# EAGLE schematic 2nd_version (EAGLE 7.3.0)
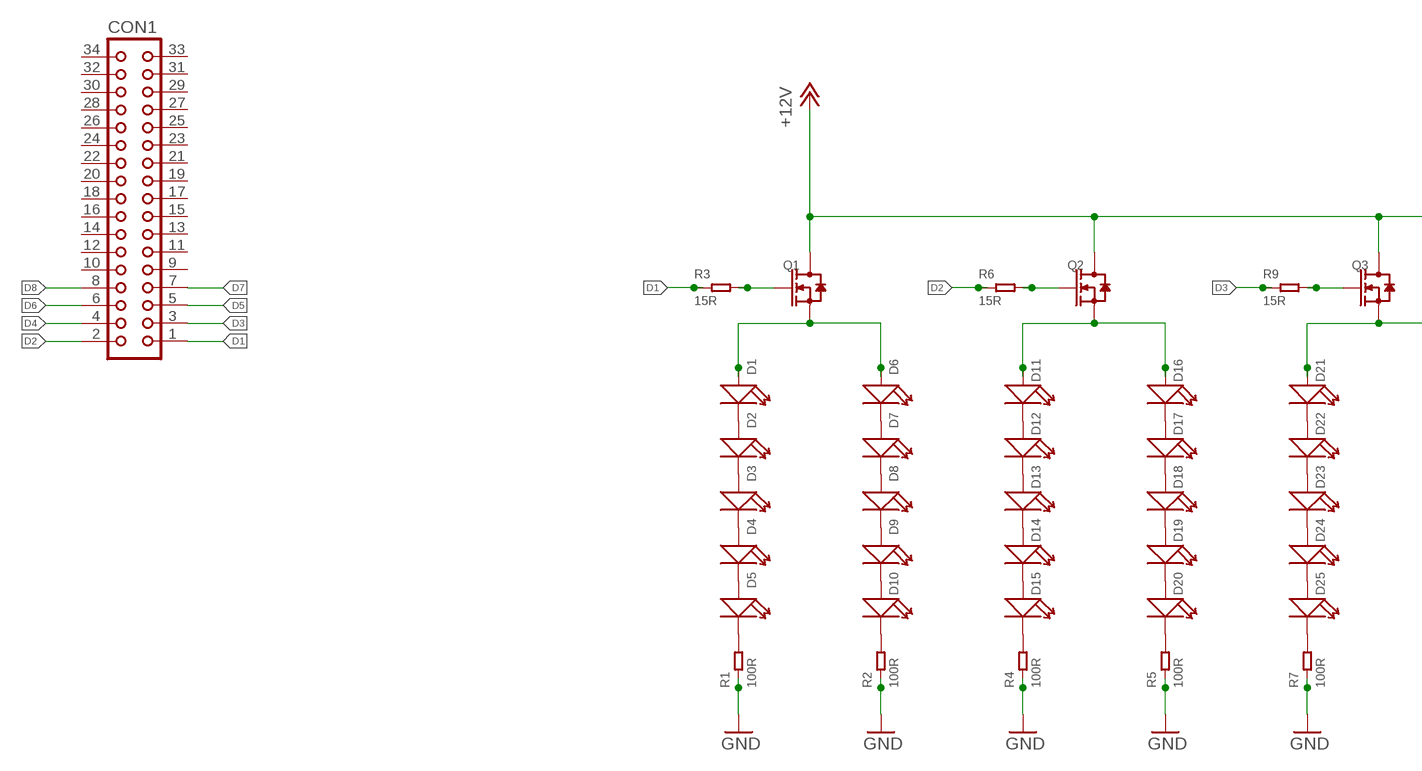
[diagram p0: schematic, sheet 1, part 1 of 2]
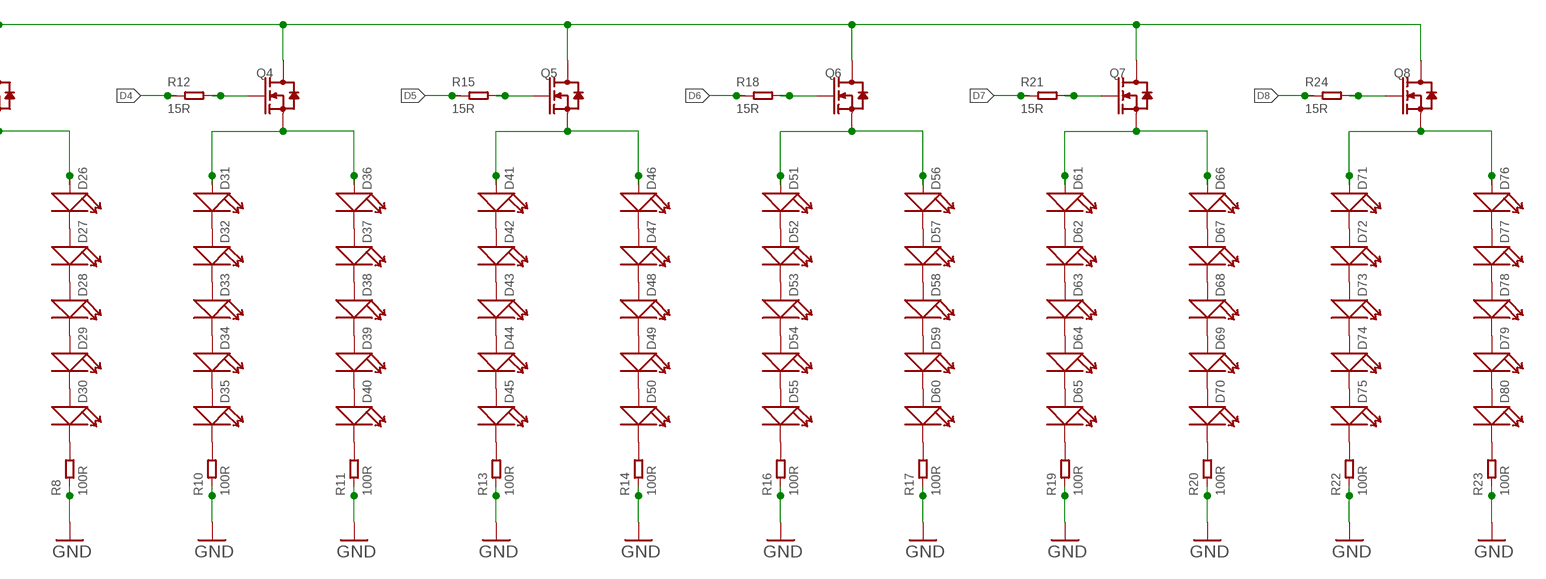
[diagram p1: schematic, sheet 1, part 2 of 2]

## Parts
CON1  CON34L  [CON34L]
D1  SMD-LED-CLEAR-YELLOW(0603)  [LED-0603]
D2  SMD-LED-CLEAR-YELLOW(0603)  [LED-0603]
D3  SMD-LED-CLEAR-YELLOW(0603)  [LED-0603]
D4  SMD-LED-CLEAR-YELLOW(0603)  [LED-0603]
D5  SMD-LED-CLEAR-YELLOW(0603)  [LED-0603]
D6  SMD-LED-CLEAR-YELLOW(0603)  [LED-0603]
D7  SMD-LED-CLEAR-YELLOW(0603)  [LED-0603]
D8  SMD-LED-CLEAR-YELLOW(0603)  [LED-0603]
D9  SMD-LED-CLEAR-YELLOW(0603)  [LED-0603]
D10  SMD-LED-CLEAR-YELLOW(0603)  [LED-0603]
D11  SMD-LED-CLEAR-YELLOW(0603)  [LED-0603]
D12  SMD-LED-CLEAR-YELLOW(0603)  [LED-0603]
D13  SMD-LED-CLEAR-YELLOW(0603)  [LED-0603]
D14  SMD-LED-CLEAR-YELLOW(0603)  [LED-0603]
D15  SMD-LED-CLEAR-YELLOW(0603)  [LED-0603]
D16  SMD-LED-CLEAR-YELLOW(0603)  [LED-0603]
D17  SMD-LED-CLEAR-YELLOW(0603)  [LED-0603]
D18  SMD-LED-CLEAR-YELLOW(0603)  [LED-0603]
D19  SMD-LED-CLEAR-YELLOW(0603)  [LED-0603]
D20  SMD-LED-CLEAR-YELLOW(0603)  [LED-0603]
D21  SMD-LED-CLEAR-YELLOW(0603)  [LED-0603]
D22  SMD-LED-CLEAR-YELLOW(0603)  [LED-0603]
D23  SMD-LED-CLEAR-YELLOW(0603)  [LED-0603]
D24  SMD-LED-CLEAR-YELLOW(0603)  [LED-0603]
D25  SMD-LED-CLEAR-YELLOW(0603)  [LED-0603]
D26  SMD-LED-CLEAR-YELLOW(0603)  [LED-0603]
D27  SMD-LED-CLEAR-YELLOW(0603)  [LED-0603]
D28  SMD-LED-CLEAR-YELLOW(0603)  [LED-0603]
D29  SMD-LED-CLEAR-YELLOW(0603)  [LED-0603]
D30  SMD-LED-CLEAR-YELLOW(0603)  [LED-0603]
D31  SMD-LED-CLEAR-YELLOW(0603)  [LED-0603]
D32  SMD-LED-CLEAR-YELLOW(0603)  [LED-0603]
D33  SMD-LED-CLEAR-YELLOW(0603)  [LED-0603]
D34  SMD-LED-CLEAR-YELLOW(0603)  [LED-0603]
D35  SMD-LED-CLEAR-YELLOW(0603)  [LED-0603]
D36  SMD-LED-CLEAR-YELLOW(0603)  [LED-0603]
D37  SMD-LED-CLEAR-YELLOW(0603)  [LED-0603]
D38  SMD-LED-CLEAR-YELLOW(0603)  [LED-0603]
D39  SMD-LED-CLEAR-YELLOW(0603)  [LED-0603]
D40  SMD-LED-CLEAR-YELLOW(0603)  [LED-0603]
D41  SMD-LED-CLEAR-YELLOW(0603)  [LED-0603]
D42  SMD-LED-CLEAR-YELLOW(0603)  [LED-0603]
D43  SMD-LED-CLEAR-YELLOW(0603)  [LED-0603]
D44  SMD-LED-CLEAR-YELLOW(0603)  [LED-0603]
D45  SMD-LED-CLEAR-YELLOW(0603)  [LED-0603]
D46  SMD-LED-CLEAR-YELLOW(0603)  [LED-0603]
D47  SMD-LED-CLEAR-YELLOW(0603)  [LED-0603]
D48  SMD-LED-CLEAR-YELLOW(0603)  [LED-0603]
D49  SMD-LED-CLEAR-YELLOW(0603)  [LED-0603]
D50  SMD-LED-CLEAR-YELLOW(0603)  [LED-0603]
D51  SMD-LED-CLEAR-YELLOW(0603)  [LED-0603]
D52  SMD-LED-CLEAR-YELLOW(0603)  [LED-0603]
D53  SMD-LED-CLEAR-YELLOW(0603)  [LED-0603]
D54  SMD-LED-CLEAR-YELLOW(0603)  [LED-0603]
D55  SMD-LED-CLEAR-YELLOW(0603)  [LED-0603]
D56  SMD-LED-CLEAR-YELLOW(0603)  [LED-0603]
D57  SMD-LED-CLEAR-YELLOW(0603)  [LED-0603]
D58  SMD-LED-CLEAR-YELLOW(0603)  [LED-0603]
D59  SMD-LED-CLEAR-YELLOW(0603)  [LED-0603]
D60  SMD-LED-CLEAR-YELLOW(0603)  [LED-0603]
D61  SMD-LED-CLEAR-YELLOW(0603)  [LED-0603]
D62  SMD-LED-CLEAR-YELLOW(0603)  [LED-0603]
D63  SMD-LED-CLEAR-YELLOW(0603)  [LED-0603]
D64  SMD-LED-CLEAR-YELLOW(0603)  [LED-0603]
D65  SMD-LED-CLEAR-YELLOW(0603)  [LED-0603]
D66  SMD-LED-CLEAR-YELLOW(0603)  [LED-0603]
D67  SMD-LED-CLEAR-YELLOW(0603)  [LED-0603]
D68  SMD-LED-CLEAR-YELLOW(0603)  [LED-0603]
D69  SMD-LED-CLEAR-YELLOW(0603)  [LED-0603]
D70  SMD-LED-CLEAR-YELLOW(0603)  [LED-0603]
D71  SMD-LED-CLEAR-YELLOW(0603)  [LED-0603]
D72  SMD-LED-CLEAR-YELLOW(0603)  [LED-0603]
D73  SMD-LED-CLEAR-YELLOW(0603)  [LED-0603]
D74  SMD-LED-CLEAR-YELLOW(0603)  [LED-0603]
D75  SMD-LED-CLEAR-YELLOW(0603)  [LED-0603]
D76  SMD-LED-CLEAR-YELLOW(0603)  [LED-0603]
D77  SMD-LED-CLEAR-YELLOW(0603)  [LED-0603]
D78  SMD-LED-CLEAR-YELLOW(0603)  [LED-0603]
D79  SMD-LED-CLEAR-YELLOW(0603)  [LED-0603]
D80  SMD-LED-CLEAR-YELLOW(0603)  [LED-0603]
Q1  SMD-MOSFET-N-CH-20V-2.1A(SOT-23)  [SOT-23]
Q2  SMD-MOSFET-N-CH-20V-2.1A(SOT-23)  [SOT-23]
Q3  SMD-MOSFET-N-CH-20V-2.1A(SOT-23)  [SOT-23]
Q4  SMD-MOSFET-N-CH-20V-2.1A(SOT-23)  [SOT-23]
Q5  SMD-MOSFET-N-CH-20V-2.1A(SOT-23)  [SOT-23]
Q6  SMD-MOSFET-N-CH-20V-2.1A(SOT-23)  [SOT-23]
Q7  SMD-MOSFET-N-CH-20V-2.1A(SOT-23)  [SOT-23]
Q8  SMD-MOSFET-N-CH-20V-2.1A(SOT-23)  [SOT-23]
R1  100R  SMD-RES-100R-5%-1/8W(0805)  [R0805]
R2  100R  SMD-RES-100R-5%-1/8W(0805)  [R0805]
R3  15R  SMD-RES-15R-5%-1/10W(0603)  [R0603]
R4  100R  SMD-RES-100R-5%-1/8W(0805)  [R0805]
R5  100R  SMD-RES-100R-5%-1/8W(0805)  [R0805]
R6  15R  SMD-RES-15R-5%-1/10W(0603)  [R0603]
R7  100R  SMD-RES-100R-5%-1/8W(0805)  [R0805]
R8  100R  SMD-RES-100R-5%-1/8W(0805)  [R0805]
R9  15R  SMD-RES-15R-5%-1/10W(0603)  [R0603]
R10  100R  SMD-RES-100R-5%-1/8W(0805)  [R0805]
R11  100R  SMD-RES-100R-5%-1/8W(0805)  [R0805]
R12  15R  SMD-RES-15R-5%-1/10W(0603)  [R0603]
R13  100R  SMD-RES-100R-5%-1/8W(0805)  [R0805]
R14  100R  SMD-RES-100R-5%-1/8W(0805)  [R0805]
R15  15R  SMD-RES-15R-5%-1/10W(0603)  [R0603]
R16  100R  SMD-RES-100R-5%-1/8W(0805)  [R0805]
R17  100R  SMD-RES-100R-5%-1/8W(0805)  [R0805]
R18  15R  SMD-RES-15R-5%-1/10W(0603)  [R0603]
R19  100R  SMD-RES-100R-5%-1/8W(0805)  [R0805]
R20  100R  SMD-RES-100R-5%-1/8W(0805)  [R0805]
R21  15R  SMD-RES-15R-5%-1/10W(0603)  [R0603]
R22  100R  SMD-RES-100R-5%-1/8W(0805)  [R0805]
R23  100R  SMD-RES-100R-5%-1/8W(0805)  [R0805]
R24  15R  SMD-RES-15R-5%-1/10W(0603)  [R0603]

## Nets
+12V: Q1.3(D) Q2.3(D) Q3.3(D) Q4.3(D) Q5.3(D) Q6.3(D) Q7.3(D) Q8.3(D)
D1: CON1.1 R3.1
D2: CON1.2 R6.1
D3: CON1.3 R9.1
D4: CON1.4 R12.1
D5: CON1.5 R15.1
D6: CON1.6 R18.1
D7: CON1.7 R21.1
D8: CON1.8 R24.1
GND: R1.1 R2.1 R4.1 R5.1 R7.1 R8.1 R10.1 R11.1 R13.1 R14.1 R16.1 R17.1 R19.1 R20.1 R22.1 R23.1
N$1: D1.- D2.+
N$2: D2.- D3.+
N$3: D3.- D4.+
N$4: D4.- D5.+
N$5: D6.- D7.+
N$6: D7.- D8.+
N$7: D8.- D9.+
N$8: D9.- D10.+
N$9: D5.- R1.2
N$10: D10.- R2.2
N$11: D1.+ D6.+ Q1.2(S)
N$12: Q1.1(G) R3.2
N$14: D11.- D12.+
N$15: D12.- D13.+
N$16: D13.- D14.+
N$17: D14.- D15.+
N$18: D16.- D17.+
N$19: D17.- D18.+
N$20: D18.- D19.+
N$21: D19.- D20.+
N$22: D15.- R4.2
N$23: D20.- R5.2
N$24: D11.+ D16.+ Q2.2(S)
N$25: Q2.1(G) R6.2
N$27: D21.- D22.+
N$28: D22.- D23.+
N$29: D23.- D24.+
N$30: D24.- D25.+
N$31: D26.- D27.+
N$32: D27.- D28.+
N$33: D28.- D29.+
N$34: D29.- D30.+
N$35: D25.- R7.2
N$36: D30.- R8.2
N$37: D21.+ D26.+ Q3.2(S)
N$38: Q3.1(G) R9.2
N$39: D31.- D32.+
N$40: D32.- D33.+
N$41: D33.- D34.+
N$42: D34.- D35.+
N$43: D36.- D37.+
N$44: D37.- D38.+
N$45: D38.- D39.+
N$46: D39.- D40.+
N$47: D35.- R10.2
N$48: D40.- R11.2
N$49: D31.+ D36.+ Q4.2(S)
N$50: Q4.1(G) R12.2
N$51: D41.- D42.+
N$52: D42.- D43.+
N$53: D43.- D44.+
N$54: D44.- D45.+
N$55: D46.- D47.+
N$56: D47.- D48.+
N$57: D48.- D49.+
N$58: D49.- D50.+
N$59: D45.- R13.2
N$60: D50.- R14.2
N$61: D41.+ D46.+ Q5.2(S)
N$62: Q5.1(G) R15.2
N$63: D51.- D52.+
N$64: D52.- D53.+
N$65: D53.- D54.+
N$66: D54.- D55.+
N$67: D56.- D57.+
N$68: D57.- D58.+
N$69: D58.- D59.+
N$70: D59.- D60.+
N$71: D55.- R16.2
N$72: D60.- R17.2
N$73: D51.+ D56.+ Q6.2(S)
N$74: Q6.1(G) R18.2
N$75: D61.- D62.+
N$76: D62.- D63.+
N$77: D63.- D64.+
N$78: D64.- D65.+
N$79: D66.- D67.+
N$80: D67.- D68.+
N$81: D68.- D69.+
N$82: D69.- D70.+
N$83: D65.- R19.2
N$84: D70.- R20.2
N$85: D61.+ D66.+ Q7.2(S)
N$86: Q7.1(G) R21.2
N$87: D71.- D72.+
N$88: D72.- D73.+
N$89: D73.- D74.+
N$90: D74.- D75.+
N$91: D76.- D77.+
N$92: D77.- D78.+
N$93: D78.- D79.+
N$94: D79.- D80.+
N$95: D75.- R22.2
N$96: D80.- R23.2
N$97: D71.+ D76.+ Q8.2(S)
N$98: Q8.1(G) R24.2
Unconnected: CON1.9 CON1.10 CON1.11 CON1.12 CON1.13 CON1.14 CON1.15 CON1.16 CON1.17 CON1.18 CON1.19 CON1.20 CON1.21 CON1.22 CON1.23 CON1.24 CON1.25 CON1.26 CON1.27 CON1.28 CON1.29 CON1.30 CON1.31 CON1.32 CON1.33 CON1.34

## Library data of the parts
CON1 = con-harting:CON34L: CONNECTOR; OC_FARNELL: unknown; OC_NEWARK: unknown
D1-D80 = Seeed-OPL-Diode:SMD-LED-CLEAR-YELLOW(0603): 304090044; MPN: 19-217-Y5C-AM1N1VY-3T
Q1-Q8 = Seeed-OPL-Transistor:SMD-MOSFET-N-CH-20V-2.1A(SOT-23): 305030015; MPN: CJ2302
R1 R2 R4 R5 R7 R8 R10 R11 R13 R14 R16 R17 R19 R20 R22 R23 = Seeed-OPL-Resistor:SMD-RES-100R-5%-1/8W(0805): 301010319; MPN: RC0805JR-07100RL
R3 R6 R9 R12 R15 R18 R21 R24 = Seeed-OPL-Resistor:SMD-RES-15R-5%-1/10W(0603): 301010231; MPN: RC0603JR-0715RL